# EAGLE design Prop Breakout5 (EAGLE 5.10)
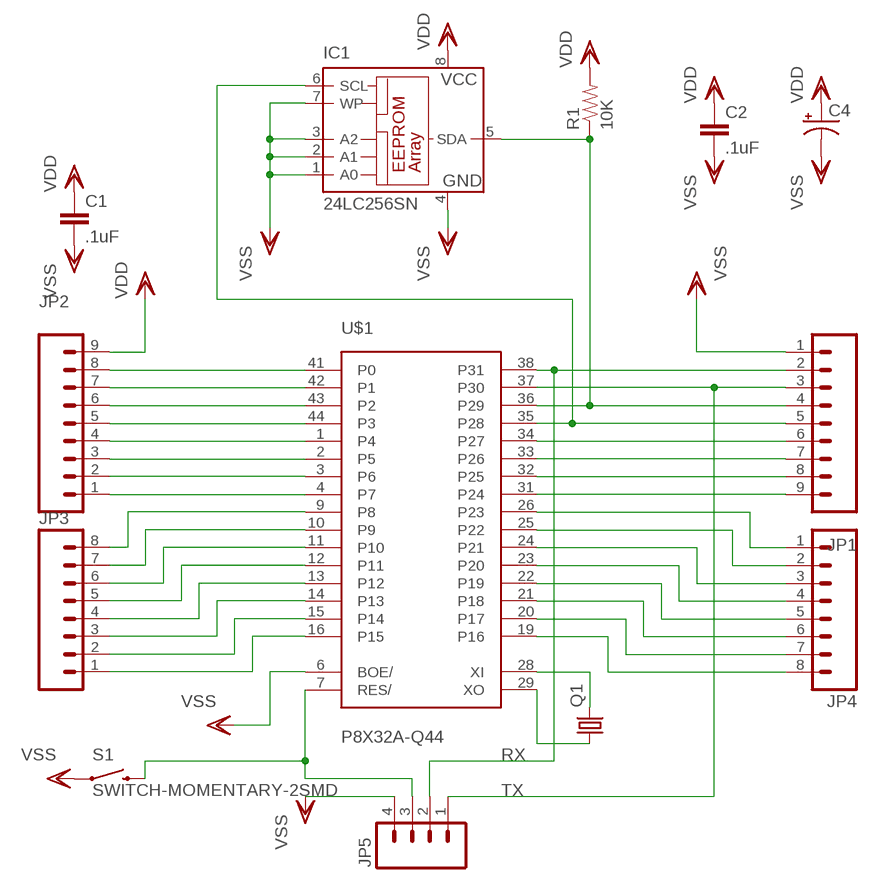
[diagram p0: schematic, sheet 1]

## Parts
C1  .1uF  CAP0805  [0805]
C2  .1uF  CAP0805  [0805]
C4  CAP_POL1206  [EIA3216]
IC1  24LC256SN  [SO-08]
JP1  M09LOCK  [1X09_LOCK]
JP2  M09LOCK  [1X09_LOCK]
JP3  M08LOCK  [1X08_LOCK]
JP4  M08LOCK  [1X08_LOCK]
JP5  M04LOCK  [1X04_LOCK]
Q1  CRYSTAL10.5X4.8  [CRYSTAL-SMD-10.5X4.8-2PIN]
R1  10K  RESISTOR  [0805]
S1  SWITCH-MOMENTARY-2SMD  [TACTILE_SWITCH_SMD]
U$1  P8X32A-Q44  [P8X32A-Q44]

## Nets
N$1: JP2.8 U$1.41(P0)
N$2: JP2.7 U$1.42(P1)
N$3: JP2.6 U$1.43(P2)
N$4: JP2.5 U$1.44(P3)
N$5: JP2.4 U$1.1(P4)
N$6: JP2.3 U$1.2(P5)
N$7: JP2.2 U$1.3(P6)
N$8: JP2.1 U$1.4(P7)
N$9: JP3.8 U$1.9(P8)
N$10: JP3.7 U$1.10(P9)
N$11: JP3.6 U$1.11(P10)
N$12: JP3.5 U$1.12(P11)
N$13: JP3.4 U$1.13(P12)
N$14: JP3.3 U$1.14(P13)
N$15: JP3.2 U$1.15(P14)
N$16: JP3.1 U$1.16(P15)
N$17: JP4.8 U$1.19(P16)
N$18: JP4.7 U$1.20(P17)
N$19: JP4.6 U$1.21(P18)
N$20: JP4.5 U$1.22(P19)
N$21: JP4.4 U$1.23(P20)
N$22: JP4.3 U$1.24(P21)
N$23: JP4.2 U$1.25(P22)
N$24: JP4.1 U$1.26(P23)
N$25: Q1.P$1 U$1.29(XO)
N$26: Q1.P$2 U$1.28(XI)
N$27: IC1.5(SDA) JP1.4 R1.1 U$1.36(P29)
N$28: IC1.6(SCL) JP1.5 U$1.35(P28)
N$29: JP1.6 U$1.34(P27)
N$30: JP1.7 U$1.33(P26)
N$31: JP1.8 U$1.32(P25)
N$32: JP1.9 U$1.31(P24)
N$34: JP5.3 S1.3 U$1.7(RES/)
RX: JP1.2 JP5.2 U$1.38(P31)
TX: JP1.3 JP5.1 U$1.37(P30)
VDD [power]: C1.1 C2.1 C4.A(+) IC1.8(VCC) JP2.9 R1.2
VSS: C1.2 C2.2 C4.C(-) IC1.1(A0) IC1.2(A1) IC1.3(A2) IC1.4(GND) IC1.7(WP) JP1.1 JP5.4 S1.1 U$1.6(BOE/)

## Power pins joined to a net without a drawn wire
VDD: U$1.8(VDD) U$1.18(VDD) U$1.30(VDD) U$1.40(VDD)
VSS: U$1.5(VSS) U$1.17(VSS) U$1.27(VSS) U$1.39(VSS)

## Library data of the parts
C1 C2 = SparkFun:CAP: Capacitor Standard 0603 ceramic capacitor, and 0.1" leaded capacitor.
C4 = SparkFun:CAP_POL: Capacitor Polarized These are standard SMD and PTH capacitors. Normally 10uF, 47uF, and 100uF in electrolytic and tantalum varieties. Always verify the external diameter of the through hole cap, it varies with capacity, voltage, and manufacturer. The EIA devices should be standard.
IC1 = microchip:24*: Serial EEPROM I2C
JP1 JP2 = SparkFun:M09: Header 9 Standard 9-pin 0.1" header. Use with straight break away headers (SKU : PRT-00116), right angle break away headers (PRT-00553), swiss pins (PRT-00743), machine pins (PRT-00117), and female headers (PRT-00115).
JP3 JP4 = SparkFun:M08: Header 8 Standard 8-pin 0.1" header. Use with straight break away headers (SKU : PRT-00116), right angle break away headers (PRT-00553), swiss pins (PRT-00743), machine pins (PRT-00117), and female headers (PRT-00115).
JP5 = SparkFun:M04: Header 4 Standard 4-pin 0.1" header. Use with straight break away headers (SKU : PRT-00116), right angle break away headers (PRT-00553), swiss pins (PRT-00743), machine pins (PRT-00117), and female headers (PRT-00115). Molex polarized connector foot print use with SKU : PRT-08231 with associated crimp pins and housings.
Q1 = SparkFun:CRYSTAL: Crystals Various standard crystals. Proven footprints. Spark Fun Electronics SKU : COM-00534
R1 = SparkFun:RESISTOR: Resistor Basic schematic elements and footprints for 0603, 1206, and PTH 1/10th watt (small) resistors.
S1 = SparkFun:SWITCH-MOMENTARY-2
U$1 = parallax propeller:P8X32A-Q44

## Net classes
1 power: width 0.305 mm

## Board
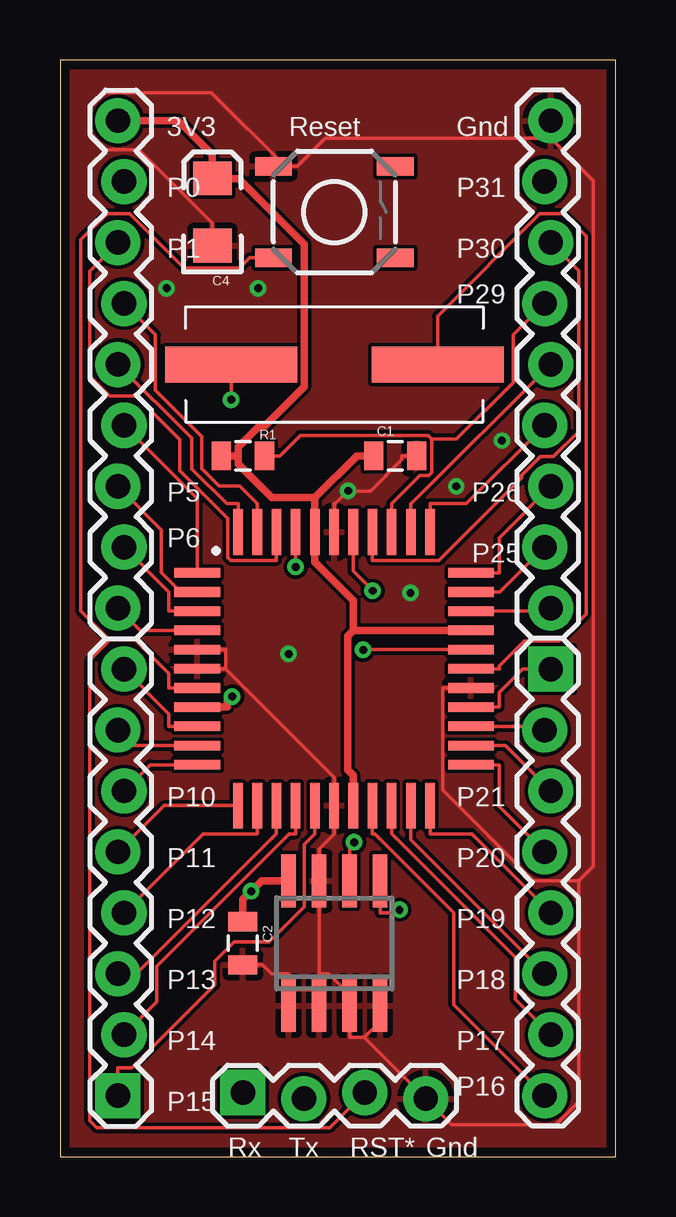
[diagram p1: board, top side]
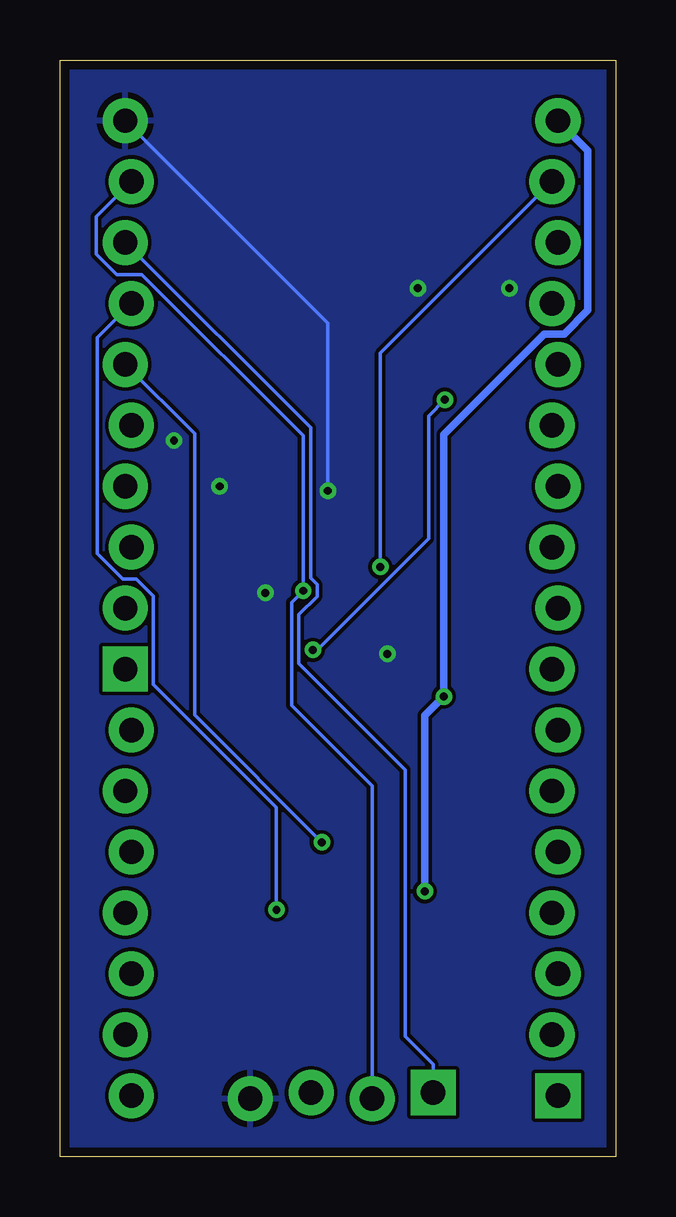
[diagram p2: board, bottom side, seen from below]

Size 23.16 x 45.71 mm. Coordinates in mm from the lower left corner, seen from the top.
Outline: 0,0 23.16,0 23.16,45.71 0,45.71 0,0
Copper layers (1*16): Top 0.0356mm / dielectric 1.5011mm / Bottom 0.0356mm
Design rules "LaenPCBOrder": minimum track width 6mil, minimum drill 13mil, track to track 6mil, track to pad 6mil, pad to pad 6mil, via to via 6mil, smd to smd 6mil, copper to edge 15mil, drill to drill 6mil, minimum pad ring 7mil, minimum via ring 7mil, stop-mask expansion 4mil, vias tented up to drill 0mil, thermal gap 10mil

### Footprints (pad centres in the part's own frame; a part is rotated, then mirrored left to right if it is on the bottom)
0805 = smd 0.8 x 1.2: 1 -0.9,0; 2 0.9,0
EIA3216 = smd 1.4 x 1.6: A 1.4,0; C -1.4,0
SO-08 = smd 0.6 x 2.2: 1 -1.905,-2.6; 2 -0.635,-2.6; 3 0.635,-2.6; 4 1.905,-2.6; 5 1.905,2.6; 6 0.635,2.6; 7 -0.635,2.6; 8 -1.905,2.6
1X09_LOCK = drill 1.016 pad 1.88 round: 1 0,0.127; 2 2.54,-0.127; 3 5.08,0.127; 4 7.62,-0.127; 5 10.16,0.127; 6 12.7,-0.127; 7 15.24,0.127; 8 17.78,-0.127; 9 20.32,0.127
1X08_LOCK = drill 1.016 pad 1.88 square: 1 0,0.127 | drill 1.016 pad 1.88 round: 2 2.54,-0.127; 3 5.08,0.127; 4 7.62,-0.127; 5 10.16,0.127; 6 12.7,-0.127; 7 15.24,0.127; 8 17.78,-0.127
1X04_LOCK = drill 1.016 pad 1.88 square: 1 0,0.127 | drill 1.016 pad 1.88 round: 2 2.54,-0.127; 3 5.08,0.127; 4 7.62,-0.127
CRYSTAL-SMD-10.5X4.8-2PIN = smd 5.5 x 1.5: P$1 -4.3,0; P$2 4.3,0
TACTILE_SWITCH_SMD = smd 1.524 x 0.762: 1 -2.54,1.905; 2 2.54,1.905; 3 -2.54,-1.905; 4 2.54,-1.905
P8X32A-Q44 = smd 1.9 x 0.4: 1 -5.713,4.013; 2 -5.713,3.212; 3 -5.713,2.413; 4 -5.713,1.613; 5 -5.713,0.812; 6 -5.713,0.013; 7 -5.713,-0.787; 8 -5.713,-1.587; 9 -5.713,-2.388; 10 -5.713,-3.188; 11 -5.713,-3.987; 23 5.688,-3.987; 24 5.688,-3.188; 25 5.688,-2.388; 26 5.688,-1.587; 27 5.688,-0.787; 28 5.688,0.013; 29 5.688,0.812; 30 5.688,1.613; 31 5.688,2.413; 32 5.688,3.212; 33 5.688,4.013 | smd 0.4 x 1.9: 12 -4.013,-5.688; 13 -3.212,-5.688; 14 -2.413,-5.688; 15 -1.613,-5.688; 16 -0.812,-5.688; 17 -0.013,-5.688; 18 0.787,-5.688; 19 1.587,-5.688; 20 2.388,-5.688; 21 3.188,-5.688; 22 3.987,-5.688; 34 3.987,5.713; 35 3.188,5.713; 36 2.388,5.713; 37 1.587,5.713; 38 0.787,5.713; 39 -0.013,5.713; 40 -0.812,5.713; 41 -1.613,5.713; 42 -2.413,5.713; 43 -3.212,5.713; 44 -4.013,5.713

### Placement (x,y rotation side)
C1  13.97,29.21 0 top
C2  7.62,8.89 270 top
C4  6.35,39.37 90 top
IC1  11.43,8.89 0 top
JP1  20.32,43.18 270 top
JP2  2.54,22.86 90 top
JP3  2.54,2.54 90 top
JP4  20.32,20.32 270 top
JP5  7.62,2.54 0 top
Q1  11.43,33.02 0 top
R1  7.62,29.21 180 top
S1  11.43,39.37 0 top
U$1  11.43,20.32 0 top

### Tracks (layer width: path | path; a pad name or v marks a point on that pad's centre or on a via)
N$1  (via drill 0.33 pad 0.69)
  Top 0.152: v9.82,24.58 9.82,24.85 U$1.41
  Bottom 0.152: JP2.8 9.82,33.49 v9.82,24.58
N$2
  Top 0.152: U$1.42 9.02,24.85 7.11,24.85 6.99,24.97 6.99,26.59 4.98,28.6 4.98,29.88 3.17,31.69 2.08,31.69 1.23,32.54 1.23,36.92 JP2.7
N$3
  Top 0.152: U$1.43 8.22,27.21 7.48,27.95 6.63,27.95 5.91,28.68 5.91,30.02 3.97,31.95 3.97,34.25 JP2.6
N$4
  Top 0.152: JP2.5 5.49,29.94 5.49,28.66 6.94,27.21 7.42,27.21 U$1.44
N$5
  Top 0.152: JP2.4 5.72,27.43 U$1.1
N$6
  Top 0.152: U$1.2 5.04,23.53 4.23,24.34 4.23,26.12 JP2.3
N$7
  Top 0.152: U$1.3 4.54,22.73 4.54,23.53 JP2.2
N$8
  Top 0.152: U$1.4 3.34,21.93 JP2.1
N$9
  Top 0.152: U$1.9 4.54,17.93 4.54,18.45 JP3.8
N$10
  Top 0.152: U$1.10 3.06,17.13 JP3.7
N$11
  Top 0.152: U$1.11 3.76,16.33 JP3.6
N$12
  Top 0.152: U$1.12 4.35,14.63 JP3.5
N$13
  Top 0.152: U$1.13 8.22,13.45 5.96,13.45 JP3.4
N$14
  Top 0.152: U$1.14 9.02,13.45 3.18,7.62 JP3.3
N$15
  Top 0.152: JP3.2 4.04,6.45 4.04,7.94 9.55,13.45 9.82,13.45 U$1.15
N$16
  Top 0.152: JP3.1 2.41,3.71 3,3.71 6.45,7.16 6.45,8.15 7.25,8.95 8.72,8.95 10.19,10.41 10.19,13.02 10.62,13.45 U$1.16
N$17
  Top 0.152: U$1.19 13.02,13.45 13.11,13.45 16.41,10.16 16.41,6.32 JP4.8
N$18
  Top 0.152: U$1.20 13.82,13.45 18.97,8.3 18.97,6.55 JP4.7
N$19
  Top 0.152: JP4.6 14.62,13.2 U$1.21
N$20
  Top 0.152: U$1.22 15.42,13.45 17.15,13.45 JP4.5
N$21
  Top 0.152: U$1.23 18.3,16.33 18.3,14.6 JP4.4
N$22
  Top 0.152: U$1.24 18.55,17.13 JP4.3
N$23
  Top 0.152: U$1.25 20.04,17.93 JP4.2
N$24
  Top 0.152: U$1.26 18.3,18.73 18.3,19.34 19.28,20.32 JP4.1
N$25  (via drill 0.33 pad 0.69)
  Top 0.152: v7.13,31.55 Q1.P$1 | U$1.29 12.64,21.13 v12.63,21.12
  Bottom 0.152: v12.63,21.12 12.45,21.12 7.81,25.76 7.81,30.87 v7.13,31.55
N$26
  Top 0.152: U$1.28 18.3,20.33 18.3,20.44 19.34,21.49 20.79,21.49 21.92,22.62 21.92,38.36 20.97,39.31 20,39.31 15.73,35.04 Q1.P$2
N$27  (via drill 0.33 pad 0.69)
  Top 0.152: 15.5,29.9 15.34,30.06 10,30.06 9.15,29.21 R1.1 | 15.5,29.9 15.5,28.52 15.37,28.38 14.99,28.38 13.82,27.21 U$1.36 | 15.5,29.9 16.52,29.9 18.89,32.27 18.89,34.25 JP1.4 | v14.15,10.29 14.02,10.16 13.34,10.16 IC1.5
  Bottom 0.152: JP1.4 21.62,34.14 21.62,25.14 20.54,24.07 19.99,24.07 19.28,23.36 19.28,19.69 14.15,14.55 v14.15,10.29
N$28  (via drill 0.33 pad 0.69)
  Top 0.152: JP1.5 14.64,27.21 14.62,27.21 U$1.35 | v12.26,13.1 12.06,12.91 IC1.6
  Bottom 0.152: JP1.5 17.56,30.13 17.56,18.4 v12.26,13.1
N$29
  Top 0.152: U$1.34 15.42,27.21 16.92,27.21 JP1.6
N$30
  Top 0.152: U$1.33 18.3,24.33 18.3,25.79 JP1.7
N$31
  Top 0.152: U$1.32 18.33,23.53 JP1.8
N$32
  Top 0.152: U$1.31 20.32,22.73 JP1.9
N$34
  Top 0.152: 2.08,21.53 1.24,20.7 1.24,1.49 1.52,1.21 11.24,1.21 JP5.3 | 2.08,21.53 3.14,21.53 4.54,20.13 4.54,19.53 U$1.7 | 2.08,21.53 0.87,22.73 0.87,38.22 1.96,39.31 2.91,39.31 5.18,37.04 7.48,37.04 7.9,37.46 S1.3
RX  (via drill 0.33 pad 0.69)
  Top 0.152: U$1.38 12.22,24.4 v13.03,23.59
  Bottom 0.152: JP5.2 10.16,15.45 13.52,18.81 13.52,23.1 v13.03,23.59 13.03,30.05 19.75,36.77 20.81,36.77 21.66,37.62 21.66,39.18 JP1.2
TX
  Top 0.152: U$1.37 13.02,24.85 15.78,24.85 19.24,28.31 19.24,28.4 20.01,29.17 20.56,29.17 21.62,30.23 21.62,36.93 JP1.3
  Bottom 0.152: JP5.1 7.62,3.84 8.79,5 8.79,16.13 13.21,20.55 13.21,22.59 12.45,23.35 12.45,23.84 12.72,24.11 12.72,30.38 JP1.3
VDD  (via drill 0.33 pad 0.69)
  Top 0.305: IC1.8 8.4,11.49 v7.96,11.06 7.62,10.71 C2.1 | U$1.18 12.22,15.89 11.98,16.12 11.98,21.7 12.22,21.93 | 12.22,21.93 12.22,23.18 10.62,24.78 U$1.40 10.62,26.66 10.62,27.29 10.62,27.46 | 12.22,21.93 U$1.30 | U$1.8 6.97,18.73 6.97,18.97 v7.17,19.17 | 7.42,29.21 7.42,29.57 8.28,30.42 8.51,30.42 10.19,32.09 10.19,38.04 7.46,40.77 C4.A 6.35,40.79 6.35,41.75 4.92,43.18 JP2.9 | 10.62,27.46 8.82,27.46 7.42,28.86 7.42,29.21 | 10.62,27.46 12.37,29.21 C1.1 | 7.42,29.21 R1.2
  Bottom 0.305: v7.96,11.06 7.96,18.38 v7.17,19.17 7.17,30.1 2.98,34.29 2.16,34.29 1.17,35.28 1.17,41.93 JP2.9
VSS  (via drill 0.33 pad 0.69)
  Top 0.152: C1.2 14.24,29.21 14.24,29.05 12.94,27.75 v12.01,27.75 11.47,27.21 11.42,27.21 U$1.39 | 21.62,11.49 22.23,12.1 22.23,40.68 20.45,42.46 | 6.9,20.33 11.42,15.81 U$1.17 11.42,13.44 10.79,12.82 IC1.7 10.79,7.62 | 6.9,20.33 U$1.6 | 6.9,20.33 6.9,21.13 U$1.5 | C4.C 6.35,38.9 3.28,41.97 1.93,41.97 1.23,42.67 1.23,43.7 1.88,44.35 6.31,44.35 9.38,41.27 | 9.38,41.27 9.88,41.27 11.06,42.46 20.45,42.46 | 9.38,41.27 S1.1 | 20.45,42.46 JP1.1 | 21.62,11.49 21.62,2.28 20.66,1.33 16.32,1.33 JP5.4 12.68,4.97 | 21.62,11.49 19.73,11.49 15.94,15.28 15.94,19.53 U$1.27 | 12.68,4.97 12.67,4.96 12.06,4.96 IC1.3 12.06,6.62 12.06,6.75 11.19,7.62 10.79,7.62 | 12.68,4.97 13.34,5.63 IC1.4 | 9.53,6.95 9.53,7.62 8.82,7.62 8.45,7.99 C2.2 | IC1.1 9.53,6.95 | 10.79,6.95 10.79,7.62 | 10.79,6.95 IC1.2 | 9.53,6.95 10.79,6.95
  Bottom 0.152: JP1.1 12.01,34.74 v12.01,27.75
  other vias: 8.26,36.2 4.45,36.2 9.53,20.95 14.61,23.49 16.51,27.94 18.41,29.85
  pour Top: 0,45.72 22.86,45.72 22.86,0 0,0
  pour Bottom: 0,45.72 22.86,45.72 22.86,0 0,0

### Text on the board
tNames: 3V3 | Reset | Gnd | P0 | P31 | P1 | P30 | P29 | P5 | P26 | P6 | P25 | P10 | P21 | P11 | P20 | P12 | P19 | P13 | P18 | P14 | P17 | P16 | P15 | Rx | Tx | RST* | Gnd